# EasyEDA schematic SCH_N64 SpyDVI_2024-02-24.json
TITLE: N64 SpyDVI; REV: 2.2; Date: 2024-02-24; Sheet: 1/1; Drawn By: Chobrenga; Company: N/A
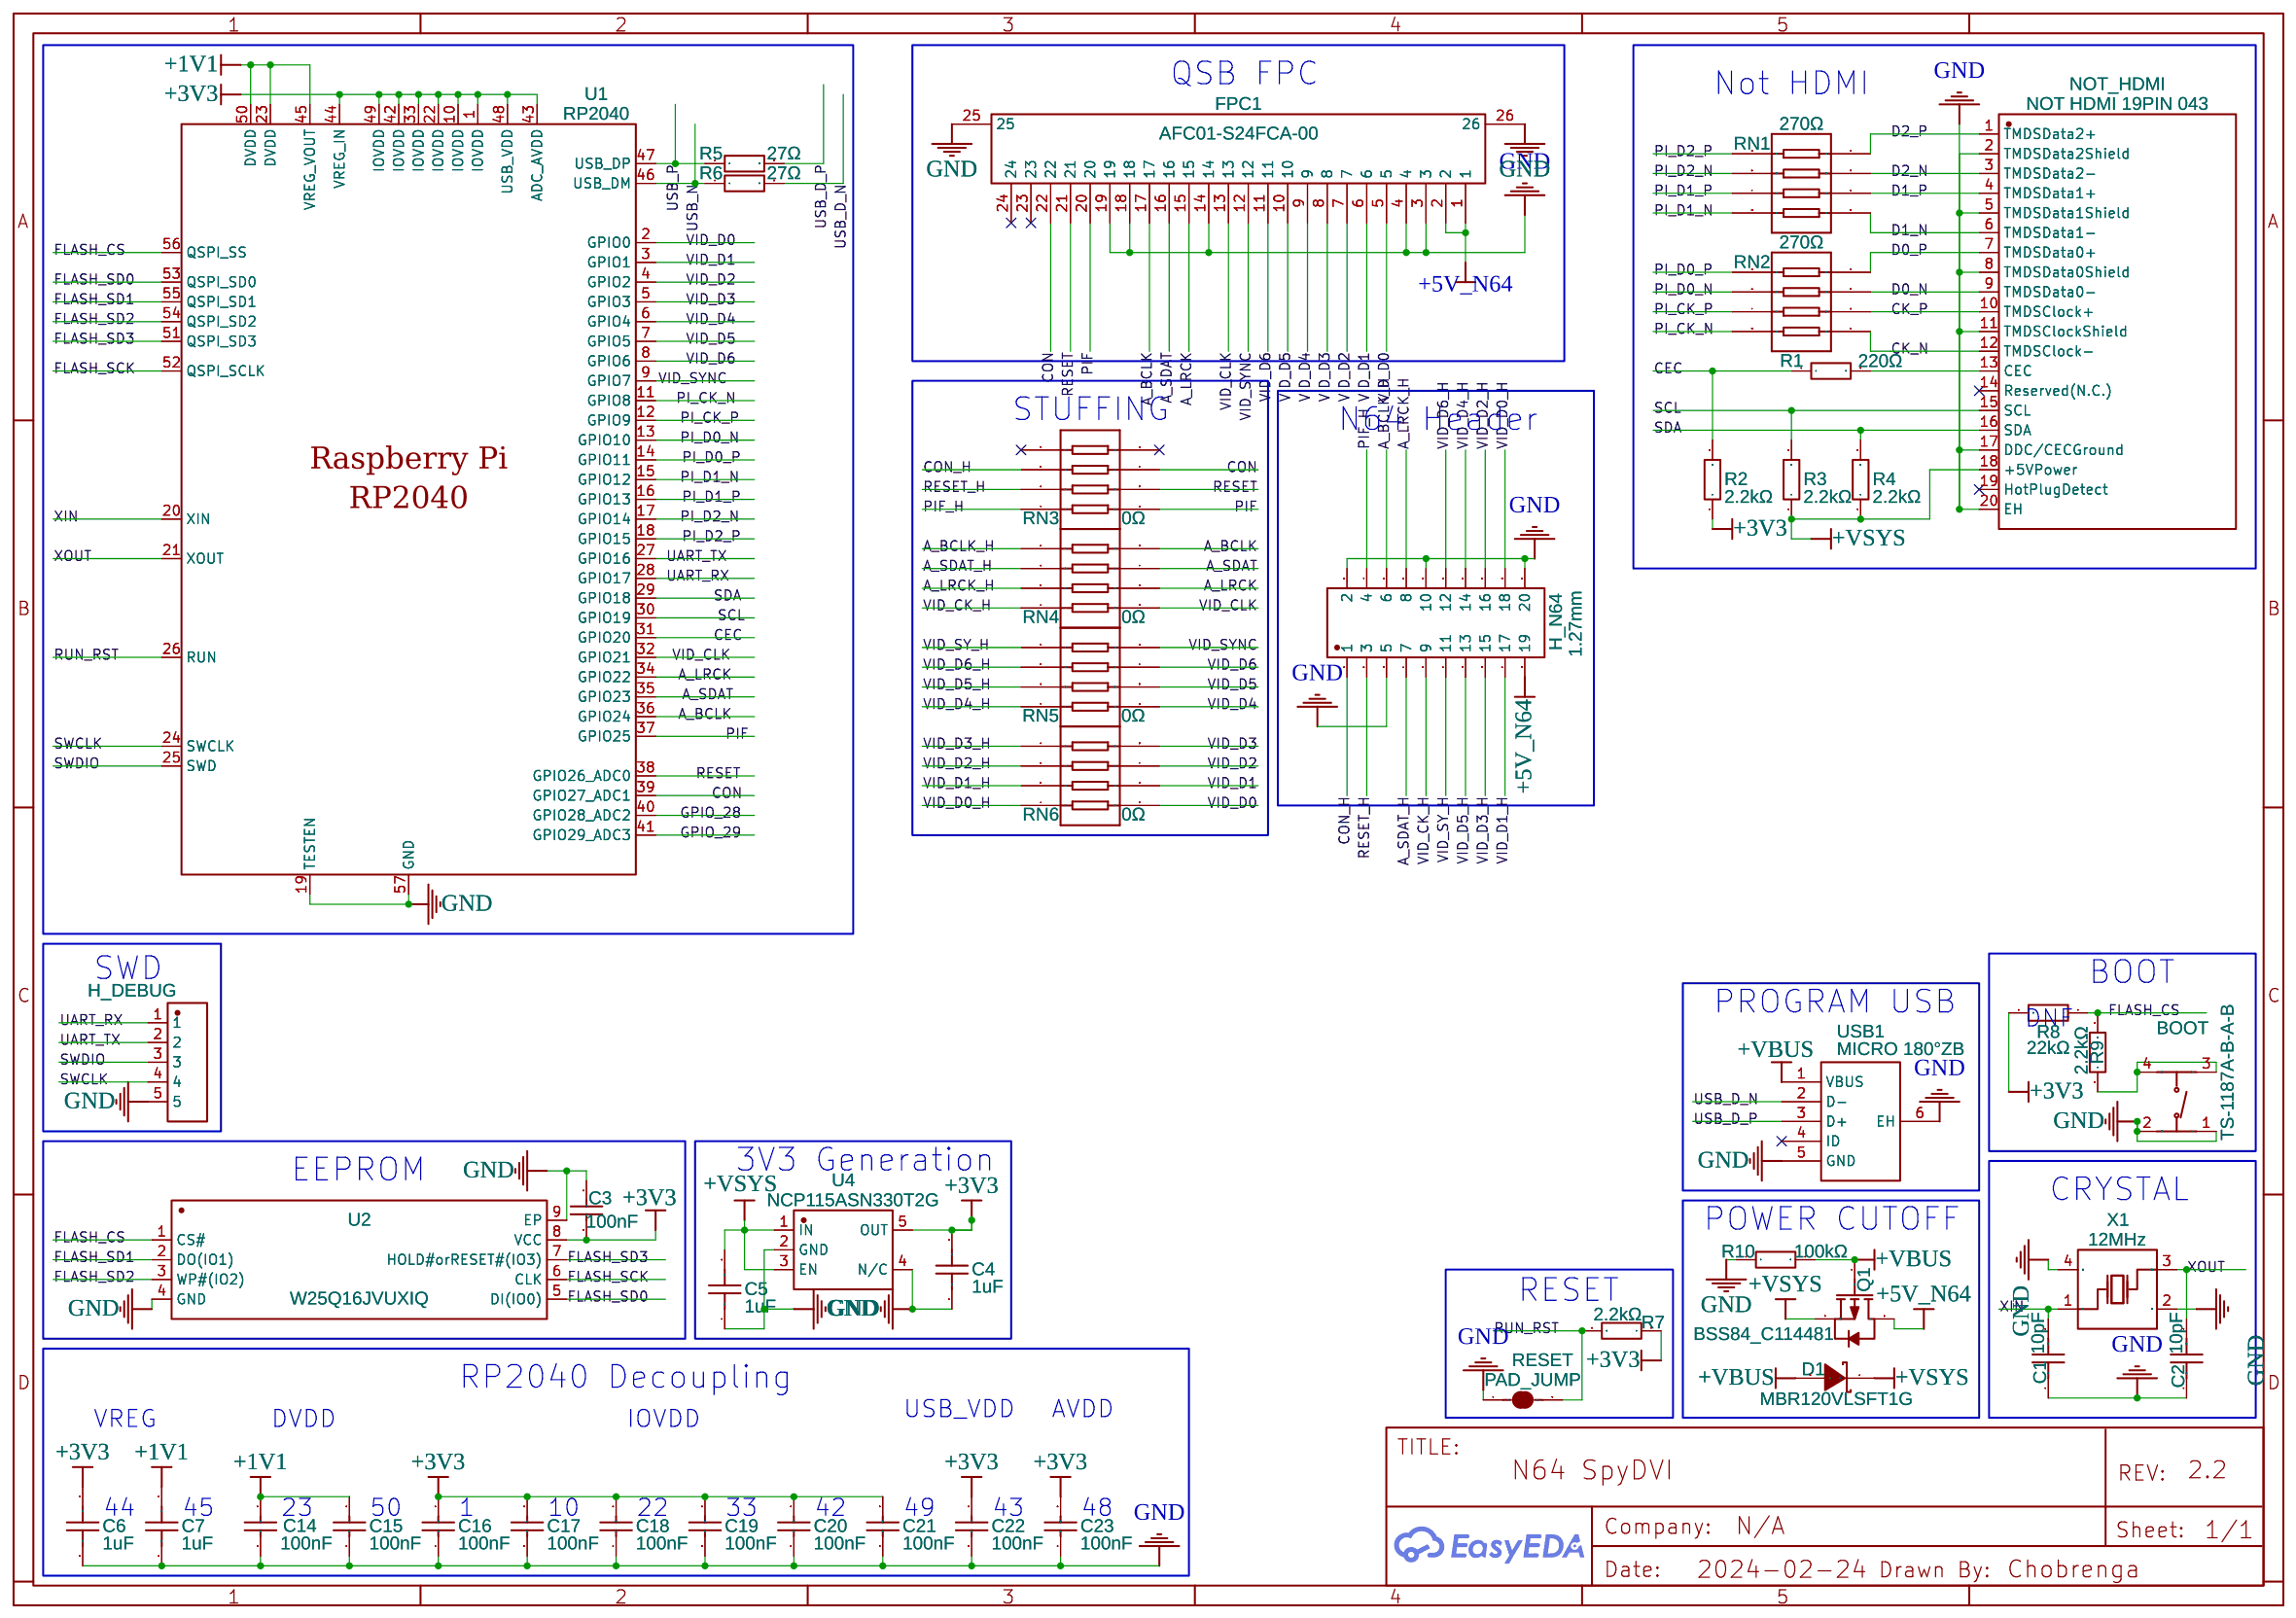
[diagram p0: schematic sheet]

## Parts
BOOT  TS-1187A-B-A-B  [SW-SMD_4P-L5.1-W5.1-P3.70-LS6.5-TL-2]
C1  10pF  [C0402]
C2  10pF  [C0402]
C3  100nF  [C0402]
C4  1uF  [C0402]
C5  1uF  [C0402]
C6  1uF  [C0402]
C7  1uF  [C0402]
C14  100nF  [C0402]
C15  100nF  [C0402]
C16  100nF  [C0402]
C17  100nF  [C0402]
C18  100nF  [C0402]
C19  100nF  [C0402]
C20  100nF  [C0402]
C21  100nF  [C0402]
C22  100nF  [C0402]
C23  100nF  [C0402]
D1  MBR120VLSFT1G  [SOD-123F_L2.8-W1.8-LS3.7-RD]
FPC1  AFC01-S24FCA-00  [FPC-SMD_P0.50-24P_FGS-XJ-H2.0]
H_DEBUG  PZ254V-11-05P  [HDR-TH_5P-P2.54-V-M]
H_N64  1.27mm  [HDR-SMD_20P-P1.27-V-M-R2-C10-S1.27-LS5.5-1]
NOT_HDMI  NOT HDMI 19PIN 043  [HDMI-SMD_HDMI-19PIN-043]
Q1  BSS84_C114481  [SOT-23-3_L2.9-W1.6-P1.90-LS2.8-BR]
R1  220Ω  [R0402]
R2  2.2kΩ  [R0402]
R3  2.2kΩ  [R0402]
R4  2.2kΩ  [R0402]
R5  27Ω  [R0402]
R6  27Ω  [R0402]
R7  2.2kΩ  [R0402]
R8  22kΩ  [R0402]
R9  2.2kΩ  [R0402]
R10  100kΩ  [R0402]
RESET  PAD_JUMP  [PAD-JUMPER-2-NO_NO_SILK]
RN1  270Ω  [RES-ARRAY-SMD_0804-8P-L2.0-W1.0-BL]
RN2  270Ω  [RES-ARRAY-SMD_0804-8P-L2.0-W1.0-BL]
RN3  0Ω  [RES-ARRAY-SMD_0402-8P-L2.0-W1.0-BL]
RN4  0Ω  [RES-ARRAY-SMD_0402-8P-L2.0-W1.0-BL]
RN5  0Ω  [RES-ARRAY-SMD_0402-8P-L2.0-W1.0-BL]
RN6  0Ω  [RES-ARRAY-SMD_0402-8P-L2.0-W1.0-BL]
U1  RP2040  [LQFN-56_L7.0-W7.0-P0.4-EP]
U2  W25Q16JVUXIQ  [USON-8_L3.0-W2.0-P0.50-BL-EP]
U4  NCP115ASN330T2G  [SOT-23-5_L3.0-W1.7-P0.95-LS2.8-BL]
USB1  MICRO 180°ZB  [MICRO-USB-TH_MICRO-180-ZB]
X1  12MHz  [CRYSTAL-SMD_4P-L3.2-W2.5-BL]

## Library data of the parts
BOOT = TS-1187A-B-A-B: Contributor: LCSC; Supplier: LCSC; Supplier Part: C318884; Manufacturer: XKB Connectivity(中国星坤); JLCPCB Part Class: Basic Part
C1 C2 = CL05C100JB5NNNC: Supplier: LCSC; Manufacturer: SAMSUNG(三星); Supplier Part: C32949; JLCPCB Part Class: Basic Part
C3 C14-C23 = CL05B104KO5NNNC: Supplier: LCSC; Manufacturer: SAMSUNG(三星); Supplier Part: C1525; JLCPCB Part Class: Basic Part
C4-C7 = CL05A105KA5NQNC: Supplier: LCSC; Manufacturer: SAMSUNG(三星); Supplier Part: C52923; JLCPCB Part Class: Basic Part
D1 = MBR120VLSFT1G: Contributor: LCSC; Supplier: LCSC; Supplier Part: C223608; Manufacturer: onsemi(安森美); JLCPCB Part Class: Extended Part
FPC1 = AFC01-S24FCA-00: Contributor: LCSC; Supplier: LCSC; Supplier Part: C262669; Manufacturer: JS(钜硕电子); JLCPCB Part Class: Extended Part
H_DEBUG = PZ254V-11-05P: Contributor: LCSC; Supplier: LCSC; Supplier Part: C492404; Manufacturer: XFCN(兴飞); JLCPCB Part Class: Extended Part
H_N64 = Double row of needle2*10 1.27mm: Supplier: LCSC; Manufacturer: BOOMELE(博穆精密); Manufacturer Part: 1.27-2*10P立贴针; Supplier Part: C59981; JLCPCB Part Class: Extended Part
NOT_HDMI = HDMI 19PIN 043: Contributor: LCSC; Supplier: LCSC; Supplier Part: C2858275; Manufacturer: SHOU HAN(首韩); JLCPCB Part Class: Extended Part; Package Display: No
Q1 = BSS84_C114481: Supplier: LCSC; Manufacturer: CJ(江苏长电/长晶); Manufacturer Part: BSS84; Supplier Part: C114481; JLCPCB Part Class: Extended Part
R1 = 0402WGF2200TCE: Supplier: LCSC; Manufacturer: UNI-ROYAL(厚声); Supplier Part: C25091; JLCPCB Part Class: Basic Part
R2-R4 R7 R9 = 0402WGF2201TCE: Supplier: LCSC; Manufacturer: UNI-ROYAL(厚声); Supplier Part: C25879; JLCPCB Part Class: Basic Part
R5 R6 = 0402WGF270JTCE: Supplier: LCSC; Manufacturer: UNI-ROYAL(厚声); Supplier Part: C25100; JLCPCB Part Class: Extended Part
R8 = 0402WGF2202TCE: Package Display: No
R10 = 0402WGF1003TCE: Supplier: LCSC; Manufacturer: UNI-ROYAL(厚声); Supplier Part: C25741; JLCPCB Part Class: Basic Part
RESET = JUMPER-PAD-2-NO: Contributor: SparkFun
RN1 RN2 = CAT10-271J4LF: Contributor: LCSC; Supplier: LCSC; Supplier Part: C148510; Manufacturer: BOURNS; JLCPCB Part Class: Extended Part
RN3-RN6 = RC-MT08W000JT: Supplier: LCSC; Manufacturer: FH(风华); Supplier Part: C2001; JLCPCB Part Class: Extended Part
U1 = RP2040: Contributor: LCSC; Supplier: LCSC; Supplier Part: C2040; Manufacturer: Raspberry Pi(树莓派); JLCPCB Part Class: Extended Part
U2 = W25Q16JVUXIQ: Contributor: lcsc; Supplier: LCSC; Supplier Part: C2843335; Manufacturer: WINBOND(华邦); JLCPCB Part Class: Extended Part
U4 = NCP115ASN330T2G: Contributor: LCSC; Supplier: LCSC; Supplier Part: C603505; Manufacturer: onsemi(安森美); JLCPCB Part Class: Extended Part
USB1 = MICRO 180°ZB: Contributor: LCSC; Supplier: LCSC; Supplier Part: C668588; Manufacturer: SHOU HAN(首韩); JLCPCB Part Class: Extended Part
X1 = X322512MMB4SI: Supplier: LCSC; Manufacturer: YXC(扬兴晶振); Supplier Part: C50430; JLCPCB Part Class: Extended Part

## Nets
+1V1: C7.2 C14.2 C15.2 U1.23(DVDD) U1.45(VREG_VOUT) U1.50(DVDD)
+3V3: C3.1 C4.2 C6.2 C16.2 C17.2 C18.2 C19.2 C20.2 C21.2 C22.2 C23.2 R2.1 R7.1 R8.2 U1.1(IOVDD) U1.10(IOVDD) U1.22(IOVDD) U1.33(IOVDD) U1.42(IOVDD) U1.43(ADC_AVDD) U1.44(VREG_IN) U1.48(USB_VDD) U1.49(IOVDD) U2.8(VCC) U4.5(OUT)
+5V_N64: FPC1.1 FPC1.2 H_N64.19 Q1.3(D)
+VBUS: D1.2(A) Q1.1(G) R10.2 USB1.1(VBUS)
GND: BOOT.1(A) BOOT.2(B) C1.1 C2.1 C3.2 C4.1 C5.1 C6.1 C7.1 C14.1 C15.1 C16.1 C17.1 C18.1 C19.1 C20.1 C21.1 C22.1 C23.1 FPC1.3 FPC1.4 FPC1.14 FPC1.18 FPC1.19 FPC1.25 FPC1.26 H_DEBUG.5 H_N64.2 H_N64.5 H_N64.10 H_N64.20 NOT_HDMI.2(TMDSData2Shield) NOT_HDMI.5(TMDSData1Shield) NOT_HDMI.8(TMDSData0Shield) NOT_HDMI.11(TMDSClockShield) NOT_HDMI.17(DDC/CECGround) NOT_HDMI.20(EH) R10.1 RESET.1 U1.19(TESTEN) U1.57(GND) U2.4(GND) U2.9(EP) U4.2(GND) U4.4(N/C) USB1.5(GND) USB1.6(EH) X1.2(GND) X1.4(GND)
+VSYS: C5.2 D1.1(K) NOT_HDMI.18(+5VPower) Q1.2(S) R3.1 R4.1 U4.1(IN) U4.3(EN)
A_BCLK: FPC1.17 RN4.8 U1.36(GPIO24)
A_BCLK_H: H_N64.6 RN4.1
A_LRCK: FPC1.15 RN4.6 U1.34(GPIO22)
A_LRCK_H: H_N64.8 RN4.3
A_SDAT: FPC1.16 RN4.7 U1.35(GPIO23)
A_SDAT_H: H_N64.7 RN4.2
CEC: R1.1 R2.2 U1.31(GPIO20)
CK_N: NOT_HDMI.12(TMDSClock-) RN2.1
CK_P: NOT_HDMI.10(TMDSClock+) RN2.2
CON: FPC1.22 RN3.7 U1.39(GPIO27_ADC1)
CON_H: H_N64.1 RN3.2
D0_N: NOT_HDMI.9(TMDSData0-) RN2.3
D0_P: NOT_HDMI.7(TMDSData0+) RN2.4
D1_N: NOT_HDMI.6(TMDSData1-) RN1.1
D1_P: NOT_HDMI.4(TMDSData1+) RN1.2
D2_N: NOT_HDMI.3(TMDSData2-) RN1.3
D2_P: NOT_HDMI.1(TMDSData2+) RN1.4
FLASH_CS: R8.1 R9.2 U1.56(QSPI_SS) U2.1(CS#)
FLASH_SCK: U1.52(QSPI_SCLK) U2.6(CLK)
FLASH_SD0: U1.53(QSPI_SD0) U2.5(DI(IO0))
FLASH_SD1: U1.55(QSPI_SD1) U2.2(DO(IO1))
FLASH_SD2: U1.54(QSPI_SD2) U2.3(WP#(IO2))
FLASH_SD3: U1.51(QSPI_SD3) U2.7(HOLD#orRESET#(IO3))
GPIO_28: U1.40(GPIO28_ADC2)
GPIO_29: U1.41(GPIO29_ADC3)
PI_CK_N: RN2.8 U1.11(GPIO8)
PI_CK_P: RN2.7 U1.12(GPIO9)
PI_D0_N: RN2.6 U1.13(GPIO10)
PI_D0_P: RN2.5 U1.14(GPIO11)
PI_D1_N: RN1.8 U1.15(GPIO12)
PI_D1_P: RN1.7 U1.16(GPIO13)
PI_D2_N: RN1.6 U1.17(GPIO14)
PI_D2_P: RN1.5 U1.18(GPIO15)
PIF: FPC1.20 RN3.5 U1.37(GPIO25)
PIF_H: H_N64.4 RN3.4
RESET: FPC1.21 RN3.6 U1.38(GPIO26_ADC0)
RESET_H: H_N64.3 RN3.3
RUN_RST: R7.2 RESET.2 U1.26(RUN)
SCL: NOT_HDMI.15(SCL) R3.2 U1.30(GPIO19)
SDA: NOT_HDMI.16(SDA) R4.2 U1.29(GPIO18)
SWCLK: H_DEBUG.4 U1.24(SWCLK)
SWDIO: H_DEBUG.3 U1.25(SWD)
UART_RX: H_DEBUG.1 U1.28(GPIO17)
UART_TX: H_DEBUG.2 U1.27(GPIO16)
USB_D_N: R6.2 USB1.2(D-)
USB_D_P: R5.2 USB1.3(D+)
USB_N: R6.1 U1.46(USB_DM)
USB_P: R5.1 U1.47(USB_DP)
VID_CK_H: H_N64.9 RN4.4
VID_CLK: FPC1.13 RN4.5 U1.32(GPIO21)
VID_D0: FPC1.5 RN6.5 U1.2(GPIO0)
VID_D0_H: H_N64.18 RN6.4
VID_D1: FPC1.6 RN6.6 U1.3(GPIO1)
VID_D1_H: H_N64.17 RN6.3
VID_D2: FPC1.7 RN6.7 U1.4(GPIO2)
VID_D2_H: H_N64.16 RN6.2
VID_D3: FPC1.8 RN6.8 U1.5(GPIO3)
VID_D3_H: H_N64.15 RN6.1
VID_D4: FPC1.9 RN5.5 U1.6(GPIO4)
VID_D4_H: H_N64.14 RN5.4
VID_D5: FPC1.10 RN5.6 U1.7(GPIO5)
VID_D5_H: H_N64.13 RN5.3
VID_D6: FPC1.11 RN5.7 U1.8(GPIO6)
VID_D6_H: H_N64.12 RN5.2
VID_SY_H: H_N64.11 RN5.1
VID_SYNC: FPC1.12 RN5.8 U1.9(GPIO7)
XIN: C1.2 U1.20(XIN) X1.1(OSC1)
XOUT: C2.2 U1.21(XOUT) X1.3(OSC2)
Net-(BOOT-3): BOOT.3(C) BOOT.4(D) R9.1
Net-(NOT_HDMI-13): NOT_HDMI.13(CEC) R1.2

Not connected (* = marked no-connect by the designer): FPC1 23* 24*; NOT_HDMI 14(Reserved(N.C.))* 19(HotPlugDetect)*; RN3 1* 8*; USB1 4(ID)*

## Notes on the sheet
- QSB FPC
- Not HDMI
- STUFFING
- N64 Header
- SWD
- BOOT
- PROGRAM USB
- DNF
- EEPROM
- 3V3 Generation
- CRYSTAL
- POWER CUTOFF
- RESET
- RP2040 Decoupling
- USB_VDD
- AVDD
- VREG
- DVDD
- IOVDD
- 44
- 45
- 23
- 50
- 1
- 10
- 22
- 33
- 42
- 49
- 43
- 48
